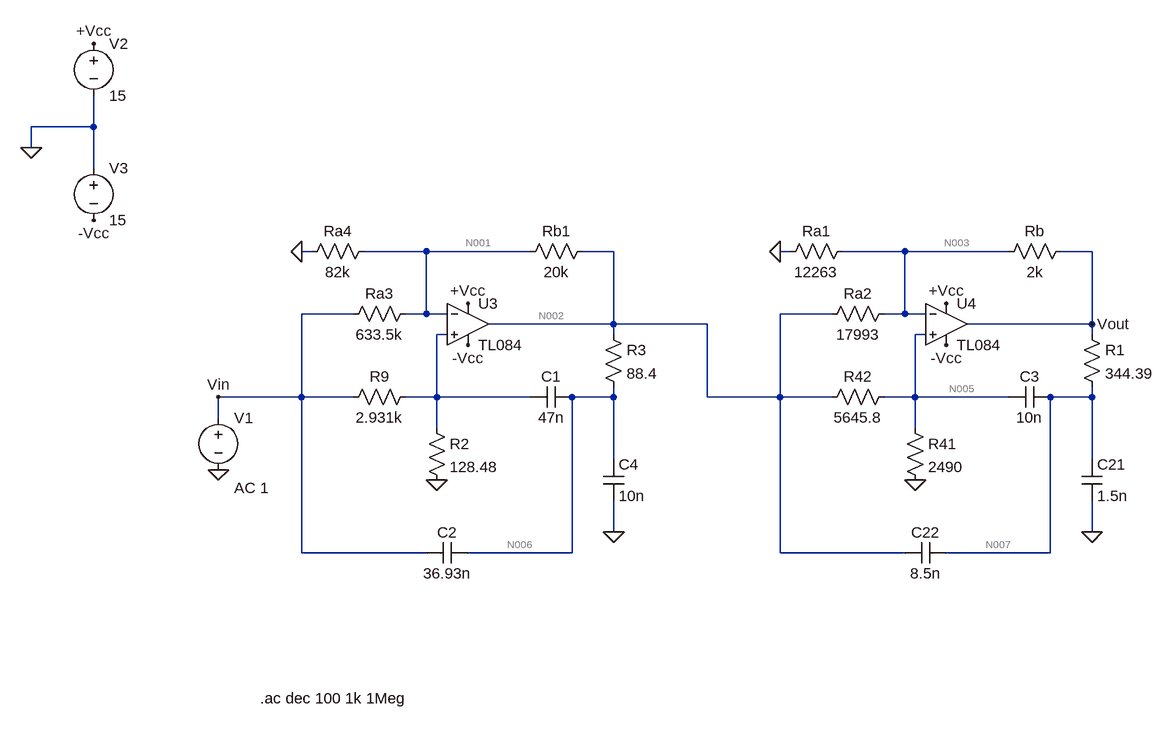
[diagram p0: schematic Sedra_double.asc]
* Sedra_double.asc
V1 Vin 0 AC 1
R42 N005 N002 5645.8
Ra2 N003 N002 17993
R41 N005 0 2490
C3 N007 N005 10n
C22 N007 N002 8.5n
Ra1 N003 0 12263
Rb Vout N003 2k
C21 N007 0 1.5n
V2 +Vcc 0 15
V3 0 -Vcc 15
R9 N004 Vin 2.931k
Ra3 N001 Vin 633.5k
R2 N004 0 128.48
C1 N006 N004 47n
C2 N006 Vin 36.93n
Ra4 N001 0 82k
Rb1 N002 N001 20k
C4 N006 0 10n
R1 Vout N007 344.39
R3 N002 N006 88.4
* U3: TL084 (symbol sympropio\TL084 not available, pins judged from their places): In+=N004 In-=N001 V+=+Vcc V-=-Vcc OUT=N002
* U4: TL084 (symbol sympropio\TL084 not available, pins judged from their places): In+=N005 In-=N003 V+=+Vcc V-=-Vcc OUT=Vout
.ac dec 100 1k 1Meg
.backanno
.end

* Results of the author's LTspice run, read from the files saved beside the schematic
* Operating Point, zero values left out:
*   V(n005) = 4.478 µV
*   V(n002) = 14.89 µV
*   V(n003) = 15.45 µV
*   V(n007) = 18.12 µV
*   V(vout) = 18.12 µV
*   V(+vcc) = 15 V
*   V(-vcc) = -15 V
*   V(n001) = 10.97 µV
*   V(n006) = 14.89 µV
*   I(Rb1) = 196.1 pA
*   I(Ra4) = 133.7 pA
*   I(R2) = -43.16 pA
*   I(Ra3) = 17.31 pA
*   I(R9) = -1.892 pA
*   I(Rb) = 1.336 nA
*   I(Ra1) = 1.26 nA
*   I(R41) = 1.799 nA
*   I(Ra2) = 31.24 pA
*   I(R42) = -1.844 nA
*   I(V3) = -28.39 mA
*   I(V2) = -28.39 mA
*   I(V1) = 15.42 pA
*   Ix(u3:1) = 45.05 pA
*   Ix(u3:2) = 45.05 pA
*   Ix(u3:3) = 14.19 mA
*   Ix(u3:4) = -14.19 mA
*   Ix(u3:5) = -2.008 nA
*   Ix(u4:1) = 45.05 pA
*   Ix(u4:2) = 45.05 pA
*   Ix(u4:3) = 14.19 mA
*   Ix(u4:4) = -14.19 mA
*   Ix(u4:5) = -1.336 nA
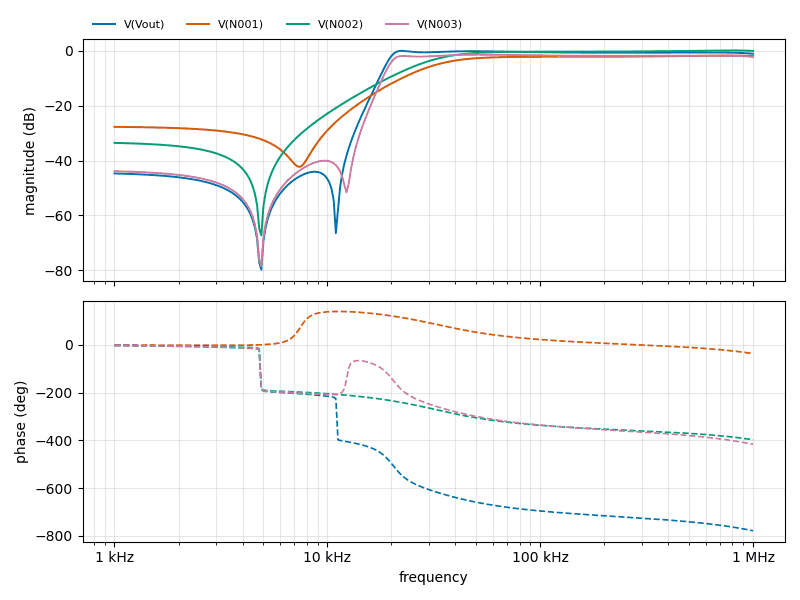
[diagram p1: AC Analysis of Sedra_double.asc, plotted from the saved traces]
* AC Analysis, 1 run:
*   V(Vout): -44.68 dB at 1 kHz, -1.06 dB at 1 MHz, peak 0.02 dB at 22.39 kHz, 3 dB below the peak at 19.53 kHz
*   V(N001): -27.69 dB at 1 kHz, -1.92 dB at 1 MHz, peak -1.71 dB at 758.6 kHz, 3 dB below the peak at 33.64 kHz
*   V(N002): -33.53 dB at 1 kHz, -0.02 dB at 1 MHz, peak 0.17 dB at 776.2 kHz, 3 dB below the peak at 32.84 kHz
*   V(N003): -43.85 dB at 1 kHz, -2.20 dB at 1 MHz, peak -1.38 dB at 51.29 kHz, 3 dB below the peak at 19.85 kHz